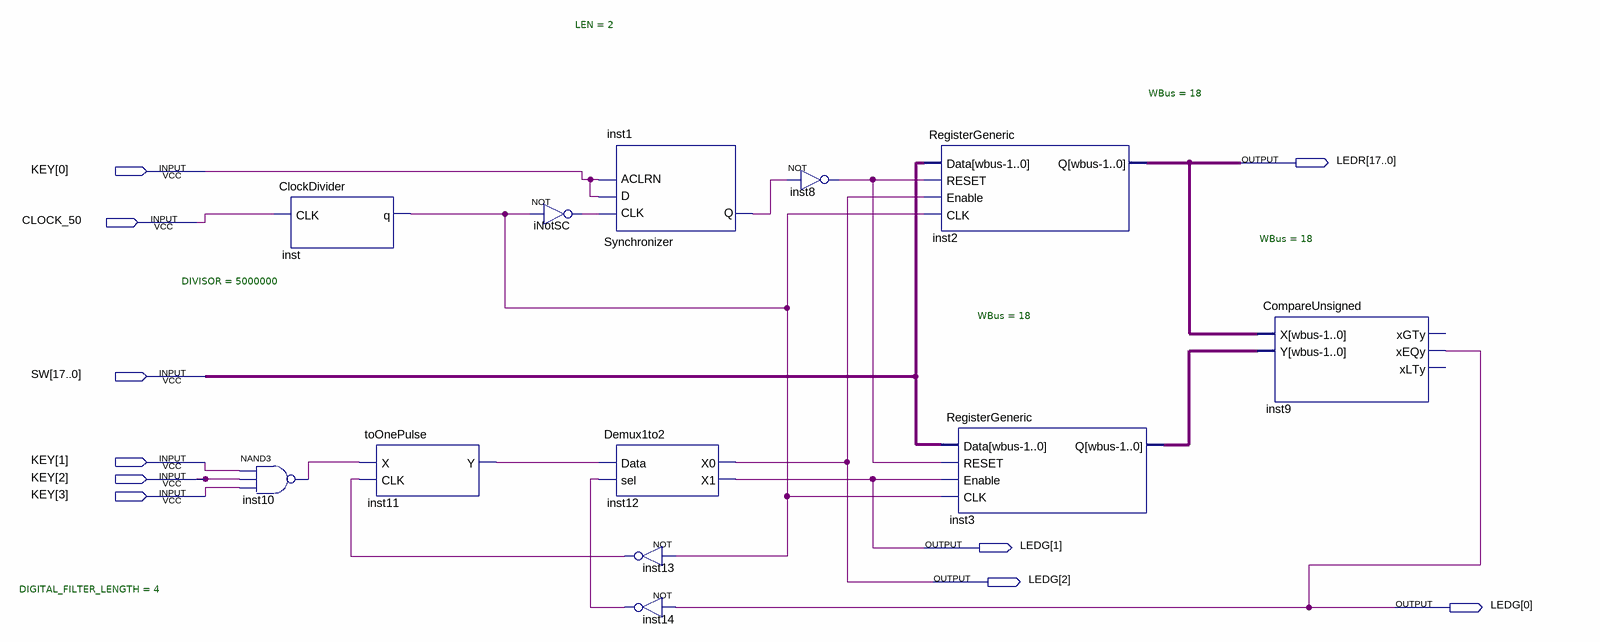
[diagram p0: schematic sheet]
// Quartus schematic CodeLock.bdf as structural Verilog: 12 symbols, 10 pins
module CodeLock (
  input  [3:0] KEY,
  input  CLOCK_50,
  input  [17:0] SW,
  output [17:0] LEDR,
  output [2:0] LEDG
);

  wire iNotSC_out, inst1_q, inst8_out, inst10_out, inst11_y, inst13_out, inst14_out, inst_q;
  wire [17:0] inst3_q;

  nand inst10 (inst10_out, KEY[1], KEY[2], KEY[3]);
  ClockDivider #(.DIVISOR(5000000)) inst (.CLK(CLOCK_50), .q(inst_q));
  toOnePulse #(.DIGITAL_FILTER_LENGTH(4)) inst11 (.X(inst10_out), .CLK(inst13_out), .Y(inst11_y));
  not iNotSC (iNotSC_out, inst_q);
  Synchronizer #(.LEN(2)) inst1 (.CLK(iNotSC_out), .D(KEY[0]), .ACLRN(KEY[0]), .Q(inst1_q));
  Demux1to2 inst12 (.Data(inst11_y), .sel(inst14_out), .X0(LEDG[2]), .X1(LEDG[1]));
  not inst13 (inst13_out, inst_q);
  not inst14 (inst14_out, LEDG[0]);
  not inst8 (inst8_out, inst1_q);
  RegisterGeneric #(.WBus(18)) inst2 (.Data(SW), .RESET(inst8_out), .Enable(LEDG[2]), .CLK(inst_q), .Q(LEDR));
  RegisterGeneric #(.WBus(18)) inst3 (.Data(SW), .RESET(inst8_out), .Enable(LEDG[1]), .CLK(inst_q), .Q(inst3_q));
  CompareUnsigned #(.WBus(18)) inst9 (.X(LEDR), .Y(inst3_q), .xEQy(LEDG[0]));  // open: xGTy, xLTy
endmodule
